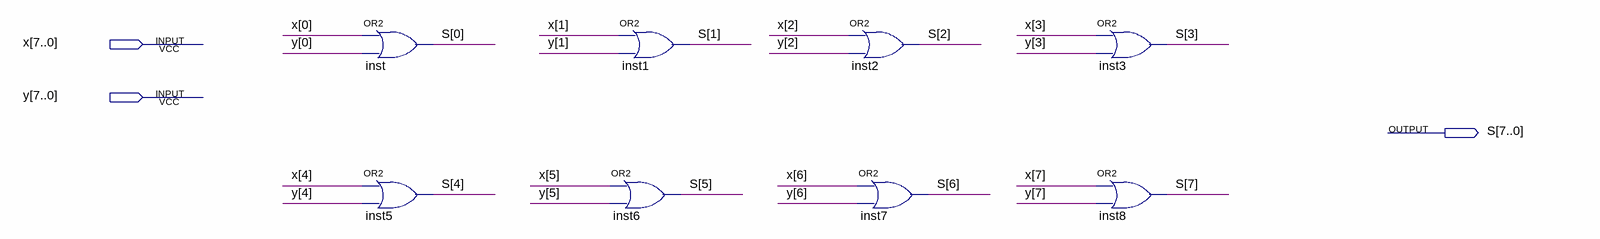
[diagram p0: schematic sheet]
// Quartus schematic OR_ULA.bdf as structural Verilog: 8 symbols, 3 pins
module OR_ULA (
  input  [7:0] x,
  input  [7:0] y,
  output [7:0] S
);

  or inst (S[0], x[0], y[0]);
  or inst5 (S[4], x[4], y[4]);
  or inst6 (S[5], x[5], y[5]);
  or inst1 (S[1], x[1], y[1]);
  or inst2 (S[2], x[2], y[2]);
  or inst7 (S[6], x[6], y[6]);
  or inst3 (S[3], x[3], y[3]);
  or inst8 (S[7], x[7], y[7]);
endmodule
